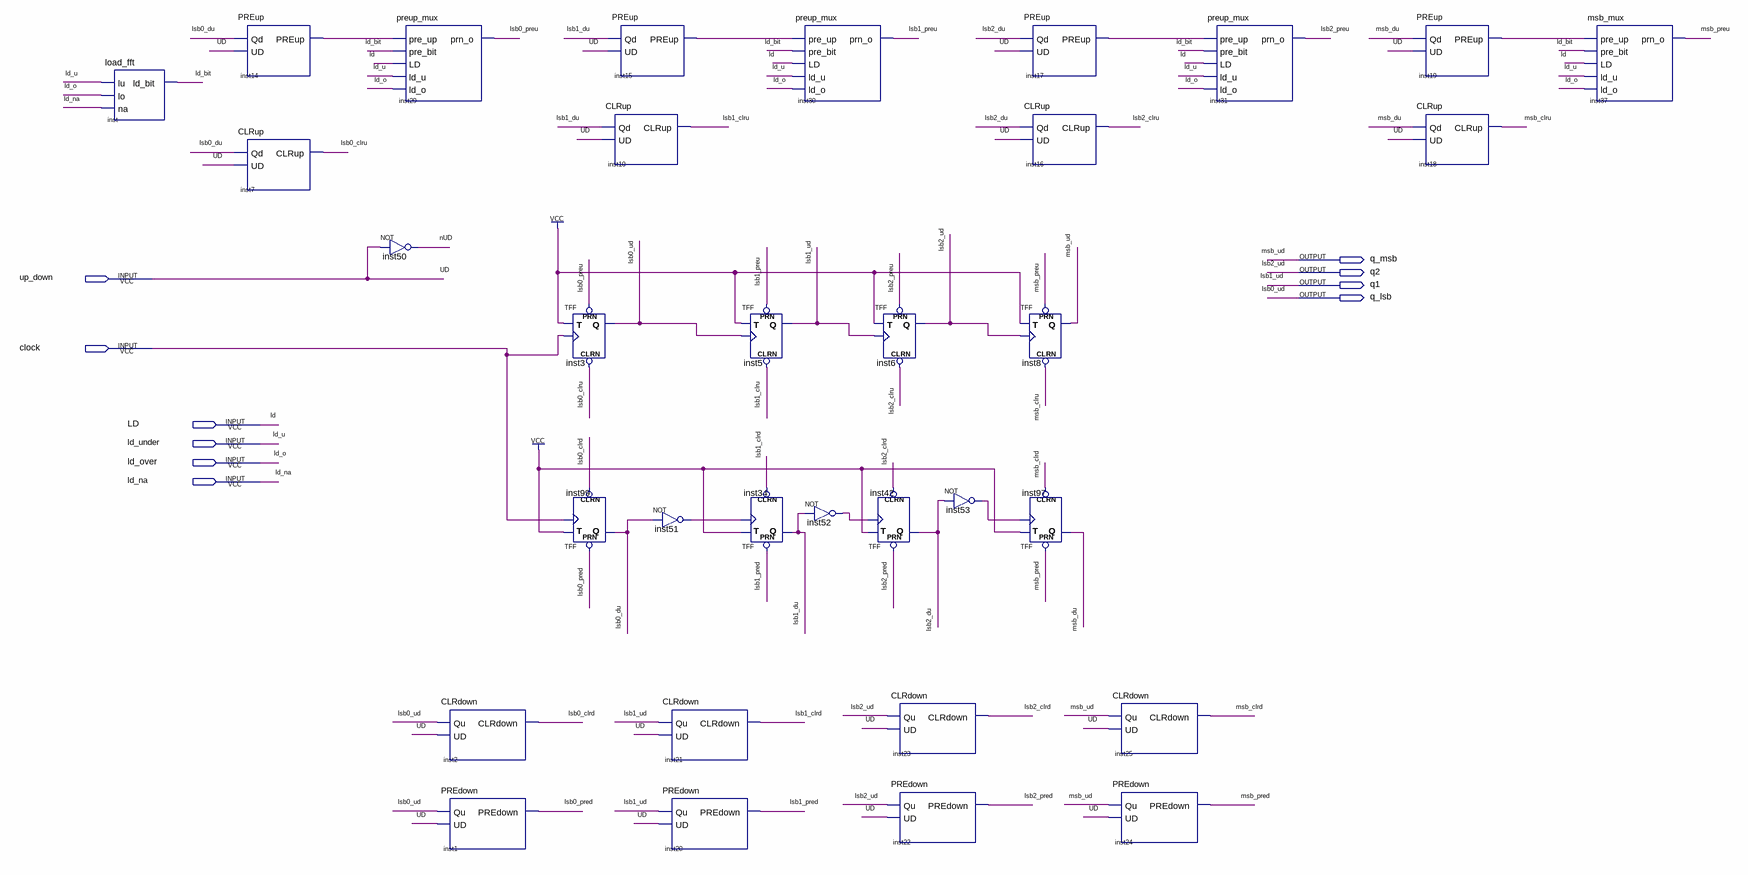
[diagram p0: schematic sheet]
// Quartus schematic up_and_down_counter_box.bdf as structural Verilog: 33 symbols, 10 pins
module up_and_down_counter_box (
  input  up_down,
  input  clock,
  input  LD,
  input  ld_under,
  input  ld_over,
  input  ld_na,
  output q_msb,
  output q2,
  output q1,
  output q_lsb
);

  wire inst14_preup, inst15_preup, inst17_preup, inst19_preup, inst51_out, inst52_out, inst53_out, ld_bit,
       lsb0_clrd, lsb0_clru, lsb0_du, lsb0_pred, lsb0_preu, lsb1_clrd, lsb1_clru, lsb1_du, lsb1_pred,
       lsb1_preu, lsb2_clrd, lsb2_clru, lsb2_du, lsb2_pred, lsb2_preu, msb_clrd, msb_clru, msb_du, msb_pred,
       msb_preu, nUD;

  load_fft inst (.lu(ld_under), .lo(ld_over), .na(ld_na), .ld_bit(ld_bit));
  PREup inst14 (.Qd(lsb0_du), .UD(up_down), .PREup(inst14_preup));
  CLRup inst7 (.Qd(lsb0_du), .UD(up_down), .CLRup(lsb0_clru));
  preup_mux inst29 (
    .pre_up(inst14_preup), .pre_bit(ld_bit), .LD(LD), .ld_u(ld_under), .ld_o(ld_over), .prn_o(lsb0_preu));
  not inst50 (nUD, up_down);
  CLRdown inst2 (.Qu(q_lsb), .UD(up_down), .CLRdown(lsb0_clrd));
  PREdown inst1 (.Qu(q_lsb), .UD(up_down), .PREdown(lsb0_pred));
  TFF inst3 (.PRN(lsb0_preu), .CLRN(lsb0_clru), .T(1'b1), .CLK(clock), .Q(q_lsb));
  TFF inst99 (.PRN(lsb0_pred), .CLRN(lsb0_clrd), .T(1'b1), .CLK(clock), .Q(lsb0_du));
  PREup inst15 (.Qd(lsb1_du), .UD(up_down), .PREup(inst15_preup));
  CLRup inst10 (.Qd(lsb1_du), .UD(up_down), .CLRup(lsb1_clru));
  not inst51 (inst51_out, lsb0_du);
  CLRdown inst21 (.Qu(q1), .UD(up_down), .CLRdown(lsb1_clrd));
  PREdown inst20 (.Qu(q1), .UD(up_down), .PREdown(lsb1_pred));
  TFF inst5 (.PRN(lsb1_preu), .CLRN(lsb1_clru), .T(1'b1), .CLK(q_lsb), .Q(q1));
  TFF inst34 (.PRN(lsb1_pred), .CLRN(lsb1_clrd), .T(1'b1), .CLK(inst51_out), .Q(lsb1_du));
  preup_mux inst30 (
    .pre_up(inst15_preup), .pre_bit(ld_bit), .LD(LD), .ld_u(ld_under), .ld_o(ld_over), .prn_o(lsb1_preu));
  not inst52 (inst52_out, lsb1_du);
  TFF inst6 (.PRN(lsb2_preu), .CLRN(lsb2_clru), .T(1'b1), .CLK(q1), .Q(q2));
  TFF inst42 (.PRN(lsb2_pred), .CLRN(lsb2_clrd), .T(1'b1), .CLK(inst52_out), .Q(lsb2_du));
  CLRdown inst23 (.Qu(q2), .UD(up_down), .CLRdown(lsb2_clrd));
  PREdown inst22 (.Qu(q2), .UD(up_down), .PREdown(lsb2_pred));
  not inst53 (inst53_out, lsb2_du);
  PREup inst17 (.Qd(lsb2_du), .UD(up_down), .PREup(inst17_preup));
  CLRup inst16 (.Qd(lsb2_du), .UD(up_down), .CLRup(lsb2_clru));
  TFF inst8 (.PRN(msb_preu), .CLRN(msb_clru), .T(1'b1), .CLK(q2), .Q(q_msb));
  TFF inst97 (.PRN(msb_pred), .CLRN(msb_clrd), .T(1'b1), .CLK(inst53_out), .Q(msb_du));
  CLRdown inst25 (.Qu(q_msb), .UD(up_down), .CLRdown(msb_clrd));
  PREdown inst24 (.Qu(q_msb), .UD(up_down), .PREdown(msb_pred));
  preup_mux inst31 (
    .pre_up(inst17_preup), .pre_bit(ld_bit), .LD(LD), .ld_u(ld_under), .ld_o(ld_over), .prn_o(lsb2_preu));
  PREup inst19 (.Qd(msb_du), .UD(up_down), .PREup(inst19_preup));
  CLRup inst18 (.Qd(msb_du), .UD(up_down), .CLRup(msb_clru));
  msb_mux inst37 (.pre_up(inst19_preup), .pre_bit(ld_bit), .LD(LD), .ld_u(ld_under), .ld_o(ld_over), .prn_o(msb_preu));

  // Other names for the same wires on the sheet: ld_o = ld_over; ld_u = ld_under; lsb0_ud = q_lsb; lsb1_ud = q1;
  //   lsb2_ud = q2; msb_ud = q_msb; UD = up_down
endmodule
